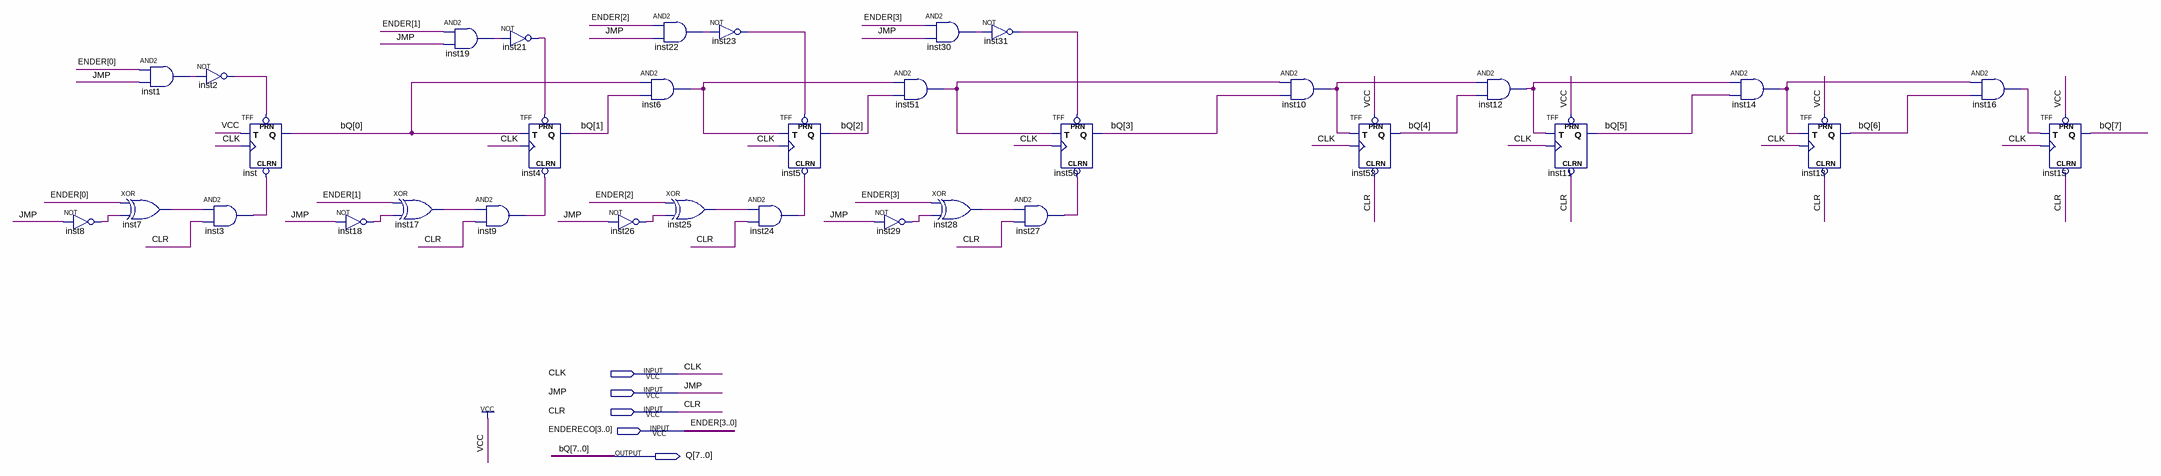
[diagram p0: schematic sheet]
// Quartus schematic Contador.bdf as structural Verilog: 34 symbols, 5 pins
module Contador (
  input  CLK,
  input  JMP,
  input  CLR,
  input  [3:0] ENDERECO,
  output [7:0] Q
);

  wire inst1_out, inst2_out, inst3_out, inst6_out, inst7_out, inst8_out, inst9_out, inst10_out, inst12_out,
       inst14_out, inst16_out, inst17_out, inst18_out, inst19_out, inst21_out, inst22_out, inst23_out,
       inst24_out, inst25_out, inst26_out, inst27_out, inst28_out, inst29_out, inst30_out, inst31_out,
       inst51_out;

  not inst8 (inst8_out, JMP);
  and inst1 (inst1_out, ENDERECO[0], JMP);
  xor inst7 (inst7_out, ENDERECO[0], inst8_out);
  not inst2 (inst2_out, inst1_out);
  and inst3 (inst3_out, inst7_out, CLR);
  TFF inst (.PRN(inst2_out), .CLRN(inst3_out), .T(1'b1), .CLK(CLK), .Q(Q[0]));
  not inst18 (inst18_out, JMP);
  xor inst17 (inst17_out, ENDERECO[1], inst18_out);
  and inst19 (inst19_out, ENDERECO[1], JMP);
  not inst21 (inst21_out, inst19_out);
  and inst9 (inst9_out, inst17_out, CLR);
  TFF inst4 (.PRN(inst21_out), .CLRN(inst9_out), .T(Q[0]), .CLK(CLK), .Q(Q[1]));
  not inst26 (inst26_out, JMP);
  and inst22 (inst22_out, ENDERECO[2], JMP);
  and inst6 (inst6_out, Q[0], Q[1]);
  not inst23 (inst23_out, inst22_out);
  xor inst25 (inst25_out, ENDERECO[2], inst26_out);
  and inst24 (inst24_out, inst25_out, CLR);
  TFF inst5 (.PRN(inst23_out), .CLRN(inst24_out), .T(inst6_out), .CLK(CLK), .Q(Q[2]));
  and inst51 (inst51_out, inst6_out, Q[2]);
  not inst29 (inst29_out, JMP);
  and inst30 (inst30_out, ENDERECO[3], JMP);
  xor inst28 (inst28_out, ENDERECO[3], inst29_out);
  not inst31 (inst31_out, inst30_out);
  and inst27 (inst27_out, inst28_out, CLR);
  TFF inst50 (.PRN(inst31_out), .CLRN(inst27_out), .T(inst51_out), .CLK(CLK), .Q(Q[3]));
  and inst10 (inst10_out, inst51_out, Q[3]);
  TFF inst52 (.PRN(1'b1), .CLRN(CLR), .T(inst10_out), .CLK(CLK), .Q(Q[4]));
  and inst12 (inst12_out, inst10_out, Q[4]);
  TFF inst11 (.PRN(1'b1), .CLRN(CLR), .T(inst12_out), .CLK(CLK), .Q(Q[5]));
  and inst14 (inst14_out, inst12_out, Q[5]);
  TFF inst13 (.PRN(1'b1), .CLRN(CLR), .T(inst14_out), .CLK(CLK), .Q(Q[6]));
  and inst16 (inst16_out, inst14_out, Q[6]);
  TFF inst15 (.PRN(1'b1), .CLRN(CLR), .T(inst16_out), .CLK(CLK), .Q(Q[7]));

  // Other names for the same wires on the sheet: bQ[7:0] = Q; ENDER[3:0] = ENDERECO
endmodule
